# EasyEDA schematic SCH_FletchVR_2024-06-24.json
TITLE: Fletch VR - A custom SlimeVR carrier board; REV: 2.0; Date: 2024-06-23; Sheet: 1/1; Company: Fletchworks
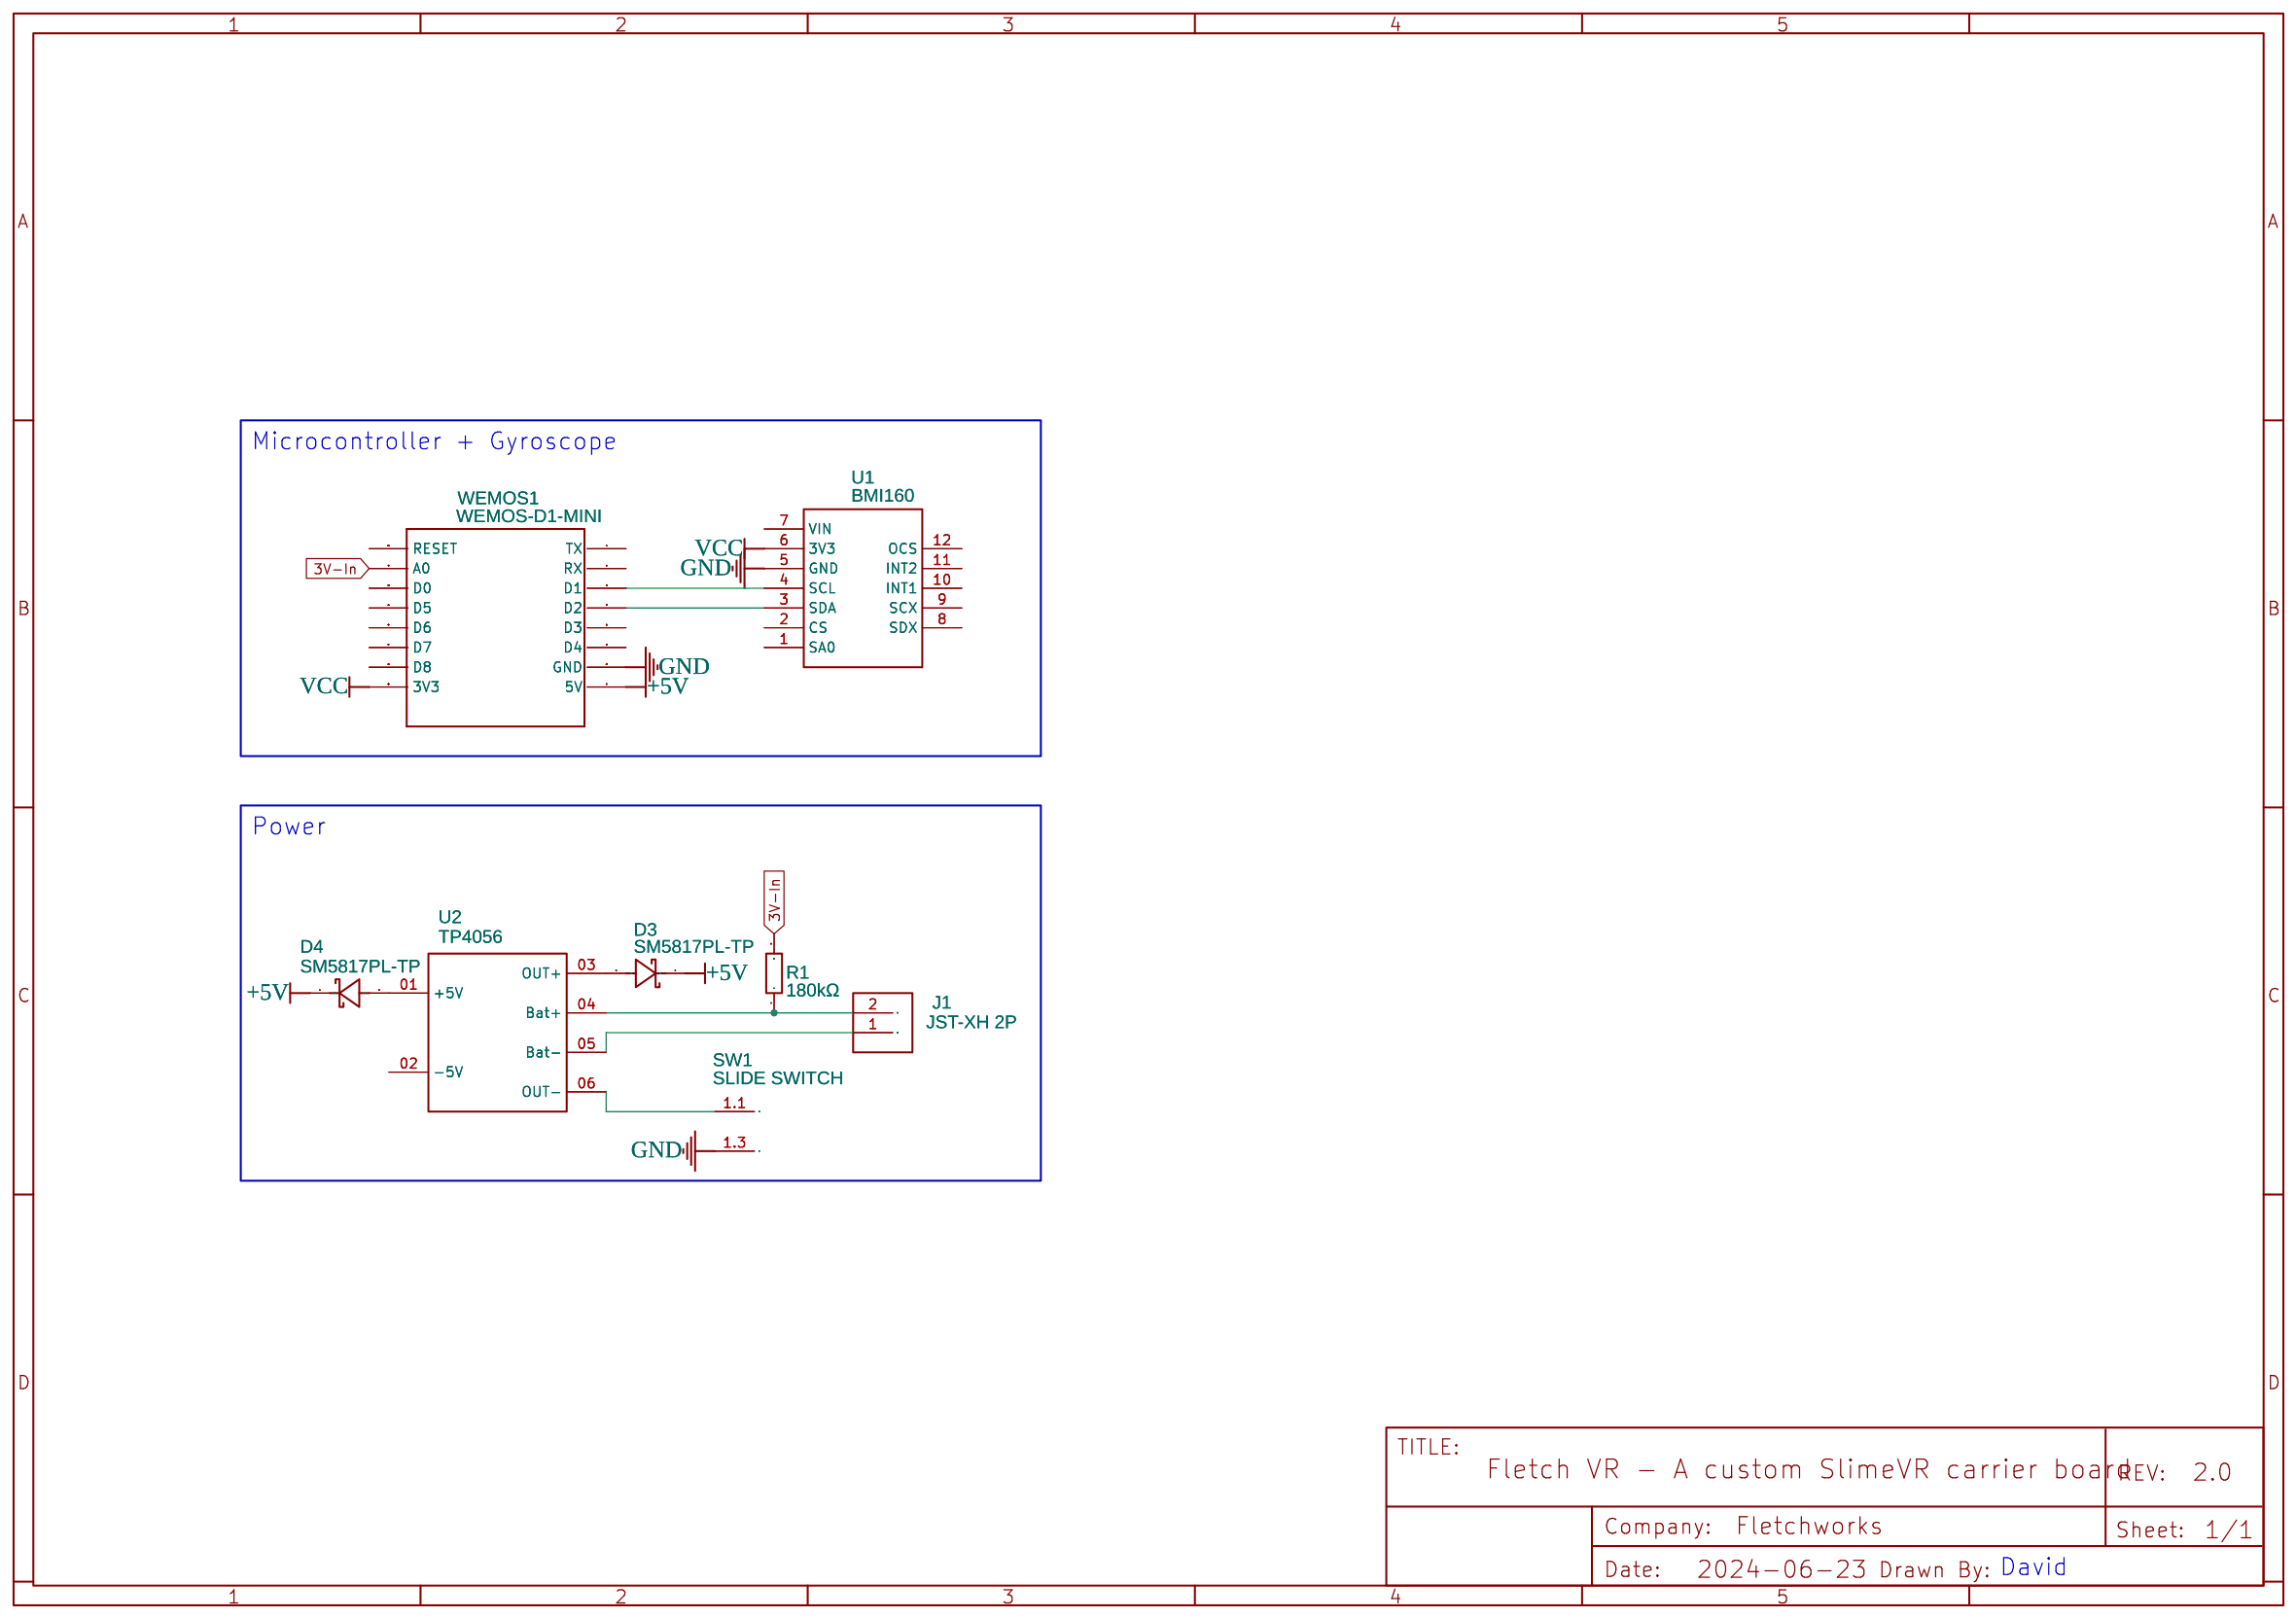
[diagram p0: schematic sheet]

## Parts
D3  SM5817PL-TP  [SOD-123FL_L2.8-W1.7-LS3.6-RD]
D4  SM5817PL-TP  [SOD-123FL_L2.8-W1.7-LS3.6-RD]
J1  JST-XH 2P  [JST-XH 2P]
R1  180kΩ  [R0402]
SW1  SLIDE SWITCH  [2P2T-SS22F32]
U1  BMI160  [BMI160]
U2  TP4056  [TP4056]
WEMOS1  WEMOS-D1-MINI  [WEMOS-D1-MINI]

## Library data of the parts
D3 D4 = SM5817PL-TP: Contributor: LCSC; Supplier: LCSC; Supplier Part: C669022; Manufacturer: MCC(美微科); JLCPCB Part Class: Extended Part
J1 = JST-XH 2P: Contributor: Epicycler; sourceId: TRL3lfxPJ
R1 = RMCF0402JT180K: Contributor: LCSC; Supplier: LCSC; Supplier Part: C237748; Manufacturer: SEI(Stackpole Electronics Inc.); JLCPCB Part Class: Extended Part
SW1 = SLIDE SWITCH 2P2T - SS22F32 PCB SLIME: Manufacturer Part: SS22F32; Supplier Part: SS22F32; Supplier: AliExpress; Link: https://www.aliexpress.com/item/High-Quality-10-Pcs-2-Position-DPDT-2P2T-Panel-Mount-Vertical-Slide-Switch-6-Pin-0/32738051861.html?spm=2114.13010708.0.0.skYvMp; Price (USD): 0.13; Contributor: huhwhyareyouhere
U1 = BMI160: Contributor: katze2005
U2 = TP4056 Symbole (modul): Contributor: telaspulenbauer
WEMOS1 = WEMOS-D1-MINI: Contributor: stufi1983

## Nets
3V-In: R1.2 WEMOS1.A0
+5V: D3.1(C) D4.1(C) WEMOS1.5V
GND: SW1.1.3(2) U1.5(GND) WEMOS1.GND
VCC: U1.6(3V3) WEMOS1.3V3
Net-(D3-2): D3.2(A) U2.03(OUT+)
Net-(D4-2): D4.2(A) U2.01(+5V)
Net-(J1-1): J1.1 U2.05(Bat-)
Net-(J1-2): J1.2 R1.1 U2.04(Bat+)
Net-(SW1-1.1): SW1.1.1(1) U2.06(OUT-)
Net-(U1-3): U1.3(SDA) WEMOS1.D2
Net-(U1-4): U1.4(SCL) WEMOS1.D1

Not connected (* = marked no-connect by the designer): U1 1(SA0) 2(CS) 7(VIN) 8(SDX) 9(SCX) 10(INT1) 11(INT2) 12(OCS); U2 02(-5V); WEMOS1 D0 D3 D4 D5 D6 D7 D8 RESET RX TX

## Notes on the sheet
- Microcontroller + Gyroscope
- Power
- David
